# Altium schematic sheet MCU042A_HOST INTERFACE.SchDoc: Host Interface
size 558 x 431 mm; Date: Not shown in title block; ApprovedBy: Not shown in title block; CheckedBy: Not shown in title block; Author: Not shown in title block; CompanyName: Not shown in title block; DrawnBy: Vince Rodriguez; Engineer: Not shown in title block; Organization: Not shown in title block; Address1: Not shown in title block; Address2: Not shown in title block; Address3: Not shown in title block; Address4: Not shown in title block; DocumentNumber: 3; Revision: Use project parameter SCH_Rev; SheetNumber: 3; SheetTotal: 5; PageSetup: Record=PageOptions|CenterHorizontal=True|CenterVertical=True|PrintScale=1.00|XCorrection=1.00|YCorrection=1.00|PrintKind=0|BorderSize=5000000|LeftOffset=0|BottomOffset=0|Orientation=2|PaperLength=1000|PaperWidth=1000|Scale=100|PaperSource=15|PrintQuality=600|MediaType=1|DitherType=10|PaperKind=Letter|PrintScaleMode=1; CurrentTime: Not shown in title block; CurrentDate: Not shown in title block; Time: Not shown in title block; DocumentFullPathAndName: Not shown in title block; DocumentName: Not shown in title block; ModifiedDate: Not shown in title block; ImagePath: Not shown in title block
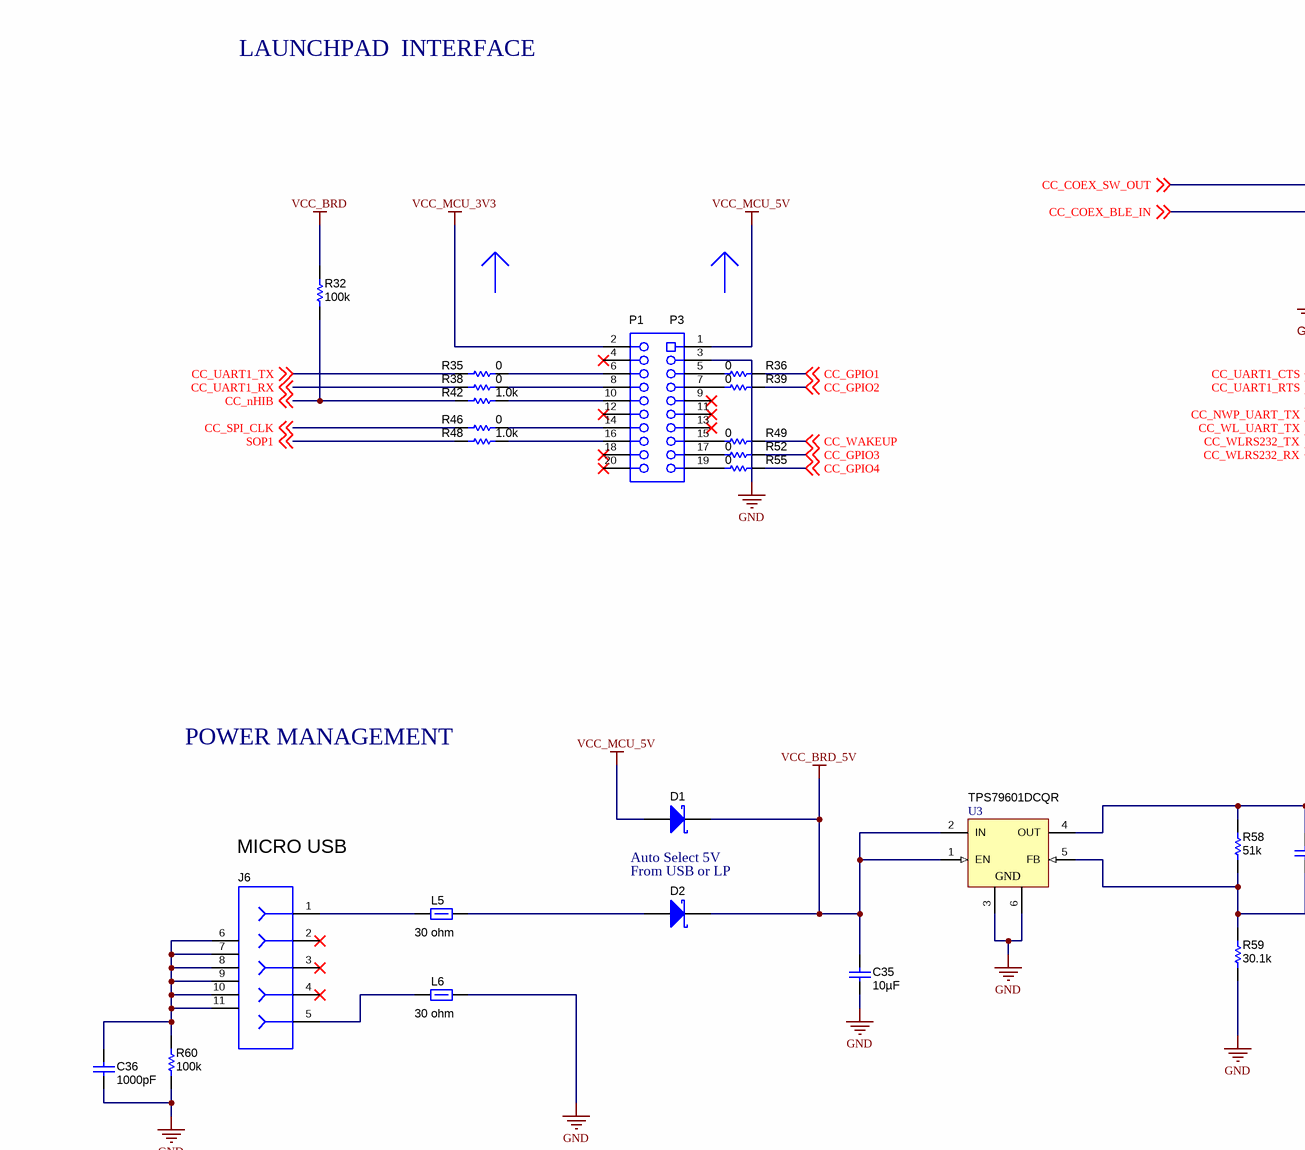
[diagram p0: MCU042A_HOST INTERFACE.SchDoc, top left]
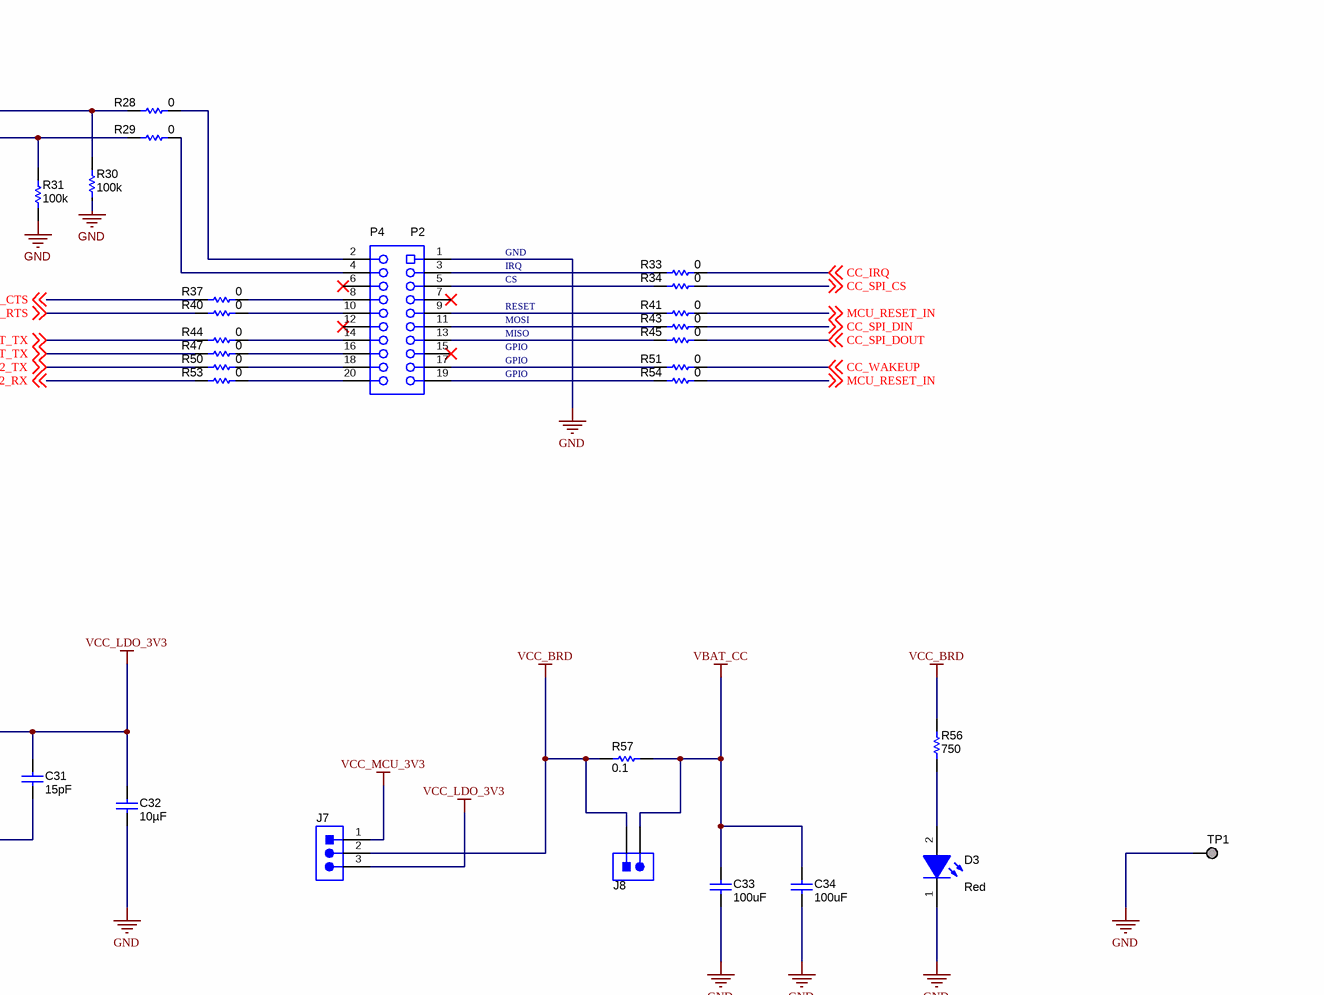
[diagram p1: MCU042A_HOST INTERFACE.SchDoc, top right]
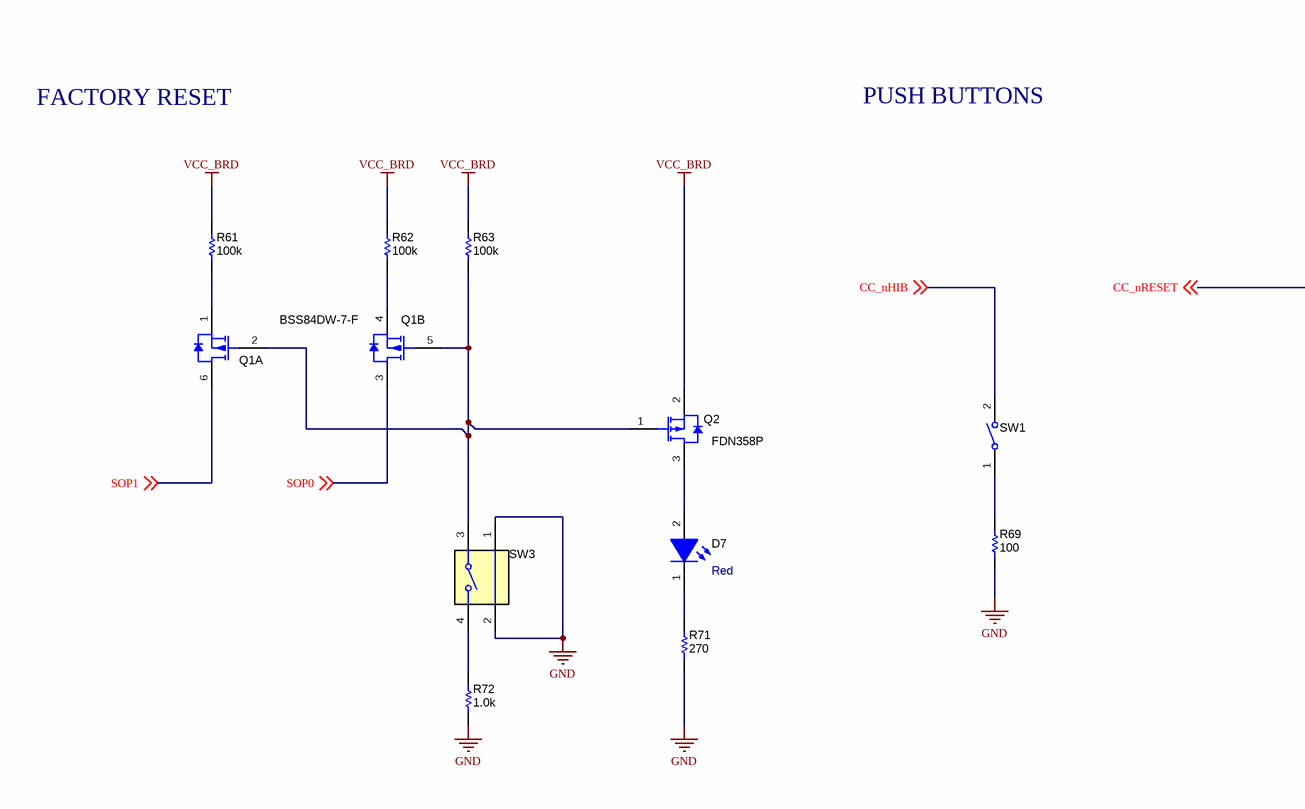
[diagram p2: MCU042A_HOST INTERFACE.SchDoc, bottom left]
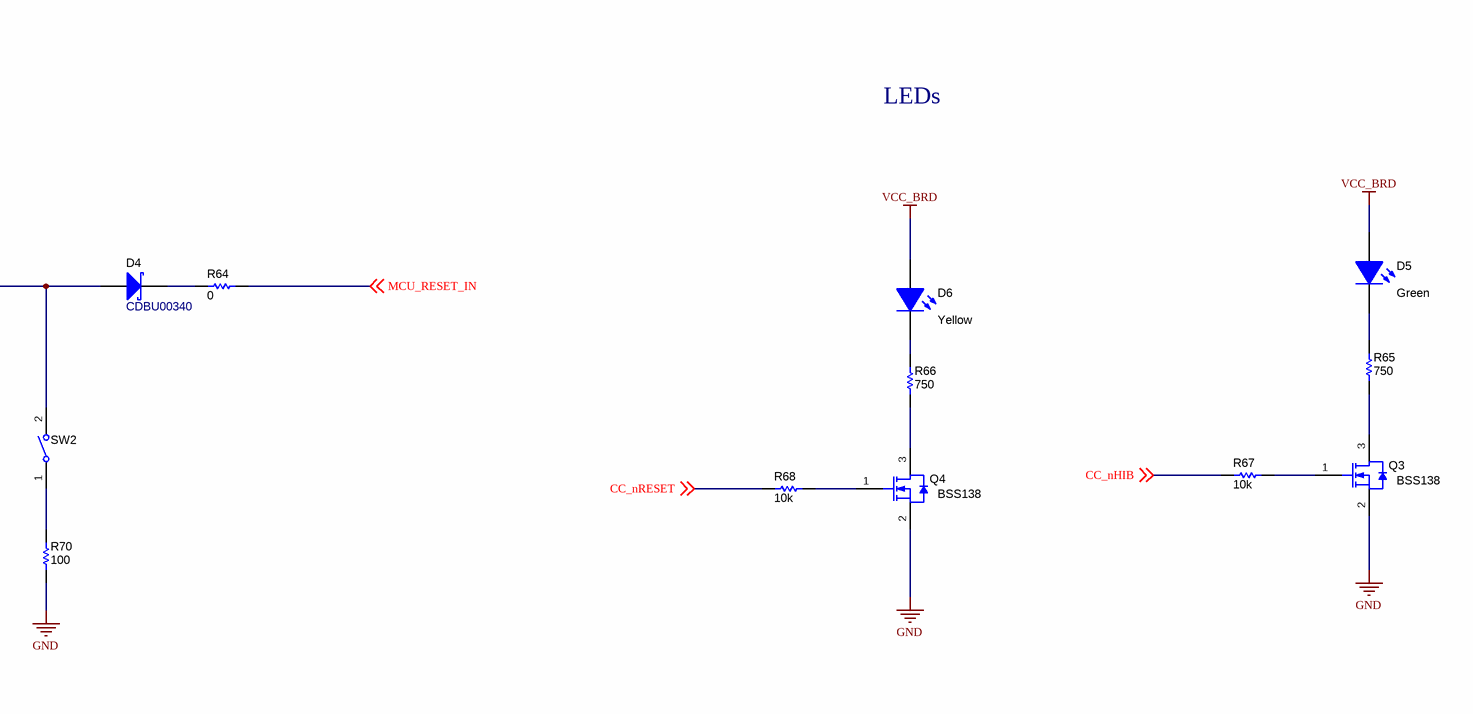
[diagram p3: MCU042A_HOST INTERFACE.SchDoc, bottom right]

## Parts
C31  ValueDisplayed: 15pF  [0402]  (hidden comment: CMP-0006420-2)
C32  ValueDisplayed: 10µF  [0805_HV]  (hidden comment: CL21A106KPFNNNE)
C33  ValueDisplayed: 100uF  [1206_180]  (hidden comment: CMP-0008934-2)
C34  ValueDisplayed: 100uF  [1206_180]  (hidden comment: CMP-0008934-2)
C35  ValueDisplayed: 10µF  [0805_HV]  (hidden comment: CL21A106KPFNNNE)
C36  ValueDisplayed: 1000pF  [0603]  (hidden comment: CL10B102KB8NNNC)
D1  CMP-0028547-1  [SOD-123]  (value not drawn)
D2  CMP-0028547-1  [SOD-123]  (value not drawn)
D3  value Red  [SML-31_Red]  (hidden comment: CMP-0002871-1)
D4  CDBU00340  [SOD-523F]
D5  value Green  [WL-SMCW_GREEN]  (hidden comment: CMP-0002905-1)
D6  value Yellow  [WL-SMCW_YELLOW]  (hidden comment: CMP-0002892-2)
D7  value Red  [SML-31_Red]  (hidden comment: CMP-0002871-2)
J6  105017-0001  [CONN_105017-0001]  (value not drawn)
J7  CMP-0075407-2  [TSW-103-07-G-S]  (value not drawn)
J8  CMP-0075500-1  [SAMTEC_HMTSW-102-07-G-S-240]  (value not drawn)
L5  value 30 ohm  [0805_HV]  (hidden comment: CMP-0003418-1)
L6  ValueDisplayed: 30 ohm  [0805_HV]  (hidden comment: CMP-0003418-1)
P1  CMP-0075442-1  [CONN_SSW-110-23-F-D]  (value not drawn)
P2  CMP-0075442-1  [CONN_SSW-110-23-F-D]  (value not drawn)
Q1  PartNumber: BSS84DW-7-F  [SOT-363]  (hidden comment: CMP-0000014-2)  (parts A,B of 2)
Q2  PartNumber: FDN358P  [SSOT-3]  (hidden comment: CMP-0000059-2)
Q3  PartNumber: BSS138  [SOT-23]  (hidden comment: CMP-0000755-1)
Q4  PartNumber: BSS138  [SOT-23]  (hidden comment: CMP-0000755-1)
R28  ValueDisplayed: 0  [0402]  (hidden comment: CMP-0026992-2)
R29  ValueDisplayed: 0  [0402]  (hidden comment: CMP-0026992-2)
R30  ValueDisplayed: 100k  [0402]  (hidden comment: CMP-0026823-3)
R31  ValueDisplayed: 100k  [0402]  (hidden comment: CMP-0026823-3)
R32  ValueDisplayed: 100k  [0603]  (hidden comment: CMP-0021990-4)
R33  ValueDisplayed: 0  [0402]  (hidden comment: CMP-0026992-2)
R34  ValueDisplayed: 0  [0402]  (hidden comment: CMP-0026992-2)
R35  ValueDisplayed: 0  [0402]  (hidden comment: CMP-0026992-2)
R36  ValueDisplayed: 0  [0402]  (hidden comment: CMP-0026992-2)
R37  ValueDisplayed: 0  [0402]  (hidden comment: CMP-0026992-2)
R38  ValueDisplayed: 0  [0402]  (hidden comment: CMP-0026992-2)
R39  ValueDisplayed: 0  [0402]  (hidden comment: CMP-0026992-2)
R40  ValueDisplayed: 0  [0402]  (hidden comment: CMP-0026992-2)
R41  ValueDisplayed: 0  [0402]  (hidden comment: CMP-0026992-2)
R42  ValueDisplayed: 1.0k  [0402]  (hidden comment: CMP-0026852-3)
R43  ValueDisplayed: 0  [0402]  (hidden comment: CMP-0026992-2)
R44  ValueDisplayed: 0  [0402]  (hidden comment: CMP-0026992-2)
R45  ValueDisplayed: 0  [0402]  (hidden comment: CMP-0026992-2)
R46  ValueDisplayed: 0  [0402]  (hidden comment: CMP-0026992-2)
R47  ValueDisplayed: 0  [0402]  (hidden comment: CMP-0026992-2)
R48  ValueDisplayed: 1.0k  [0402]  (hidden comment: CMP-0026852-3)
R49  ValueDisplayed: 0  [0402]  (hidden comment: CMP-0026992-2)
R50  ValueDisplayed: 0  [0402]  (hidden comment: CMP-0026992-2)
R51  ValueDisplayed: 0  [0402]  (hidden comment: CMP-0026992-2)
R52  ValueDisplayed: 0  [0402]  (hidden comment: CMP-0026992-2)
R53  ValueDisplayed: 0  [0402]  (hidden comment: CMP-0026992-2)
R54  ValueDisplayed: 0  [0402]  (hidden comment: CMP-0026992-2)
R55  ValueDisplayed: 0  [0402]  (hidden comment: CMP-0026992-2)
R56  ValueDisplayed: 750  [0603]  (hidden comment: CMP-0025852-4)
R57  ValueDisplayed: 0.1  [0805_HV]  (hidden comment: CMP-0021515-2)
R58  ValueDisplayed: 51k  [0402]  (hidden comment: CMP-0026945-3)
R59  ValueDisplayed: 30.1k  [0402]  (hidden comment: CMP-0026284-2)
R60  ValueDisplayed: 100k  [0402]  (hidden comment: CMP-0026823-3)
R61  ValueDisplayed: 100k  [0402]  (hidden comment: CMP-0026659-1)
R62  ValueDisplayed: 100k  [0402]  (hidden comment: CMP-0026659-1)
R63  ValueDisplayed: 100k  [0402]  (hidden comment: CMP-0026659-1)
R64  ValueDisplayed: 0  [0603]  (hidden comment: CMP-0025874-3)
R65  ValueDisplayed: 750  [0603]  (hidden comment: CMP-0025852-4)
R66  ValueDisplayed: 750  [0603]  (hidden comment: CMP-0025852-4)
R67  ValueDisplayed: 10k  [0402]  (hidden comment: CMP-0026825-5)
R68  ValueDisplayed: 10k  [0402]  (hidden comment: CMP-0026825-5)
R69  ValueDisplayed: 100  [0402]  (hidden comment: CMP-0026656-1)
R70  ValueDisplayed: 100  [0402]  (hidden comment: CMP-0026656-1)
R71  ValueDisplayed: 270  [0603]  (hidden comment: CMP-0025765-4)
R72  ValueDisplayed: 1.0k  [0402]  (hidden comment: CMP-0026852-3)
SW1  CMP-0002249-1  [SW_MJTP1117]  (value not drawn)
SW2  CMP-0002249-1  [SW_MJTP1117]  (value not drawn)
SW3  1188E-1K2-V-TR  [SW_1188E]  (value not drawn)
TP1  CMP-0003719-1  [TP_H045P075]  (value not drawn)  (no BOM)
U3  TPS79601DCQR  [DCQ0006A_N]

## Nets
GND: C32.2 C33.2 C34.2 C35.2 C36.2 D3.1(K) L6.1 P1.1 P2.3 Q3.2(S) Q4.2(S) R30.2 R31.2 R59.1 R60.2 R69.1 R70.1 R71.1 R72.1 SW3.1 SW3.2 TP1.1 U3.3(GND) U3.6(GND)
VBAT_CC: C33.1 C34.1 J8.2 R57.2
VCC_BRD: D5.2(A) D6.2(A) J7.2 J8.1 Q2.2(S) R32.2 R56.1 R57.1 R61.2 R62.2 R63.2
VCC_BRD_5V: C35.1 D1.1(K) D2.1(K) U3.1(EN) U3.2(IN)
VCC_LDO_3V3: C31.1 C32.1 J7.3 R58.2 U3.4(OUT)
VCC_MCU_3V3: J7.1 P2.2
VCC_MCU_5V: D1.2(A) P2.1
CC_COEX_BLE_IN: R29.1 R31.1 ; off-sheet CC_COEX_BLE_IN
CC_COEX_SW_OUT: R28.1 R30.1 ; off-sheet CC_COEX_SW_OUT
CC_GPIO1: R36.2 ; off-sheet CC_GPIO1
CC_GPIO2: R39.2 ; off-sheet CC_GPIO2
CC_GPIO3: R52.2 ; off-sheet CC_GPIO3
CC_GPIO4: R55.2 ; off-sheet CC_GPIO4
CC_IRQ: R33.2 ; off-sheet CC_IRQ
CC_nHIB: R32.1 R42.1 R67.1 SW1.2 ; off-sheet CC_nHIB
CC_nRESET: D4.2(A) R68.1 SW2.2 ; off-sheet CC_nRESET
CC_NWP_UART_TX: R44.1 ; off-sheet CC_NWP_UART_TX
CC_SPI_CLK: R46.1 ; off-sheet CC_SPI_CLK
CC_SPI_CS: R34.2 ; off-sheet CC_SPI_CS
CC_SPI_DIN: R43.2 ; off-sheet CC_SPI_DIN
CC_SPI_DOUT: R45.2 ; off-sheet CC_SPI_DOUT
CC_UART1_CTS: R37.1 ; off-sheet CC_UART1_CTS
CC_UART1_RTS: R40.1 ; off-sheet CC_UART1_RTS
CC_UART1_RX: R38.1 ; off-sheet CC_UART1_RX
CC_UART1_TX: R35.1 ; off-sheet CC_UART1_TX
CC_WAKEUP: R49.2 R51.2 ; off-sheet CC_WAKEUP
CC_WL_UART_TX: R47.1 ; off-sheet CC_WL_UART_TX
CC_WLRS232_RX: R53.1 ; off-sheet CC_WLRS232_RX
CC_WLRS232_TX: R50.1 ; off-sheet CC_WLRS232_TX
MCU_RESET_IN: R41.2 R54.2 R64.2 ; off-sheet MCU_RESET_IN
SOP0: Q1.3(D) ; off-sheet SOP0
SOP1: Q1.6(D) R48.1 ; off-sheet SOP1
NetC31_2: C31.2 R58.1 R59.2 U3.5(FB)
NetC36_1: C36.1 J6.6 J6.7 J6.8 J6.9 J6.10 J6.11 R60.1
NetD2_2: D2.2(A) L5.2
NetD3_2: D3.2(A) R56.2
NetD4_1: D4.1(K) R64.1
NetD5_1: D5.1(K) R65.1
NetD6_1: D6.1(K) R66.1
NetD7_1: D7.1(K) R71.2
NetD7_2: D7.2(A) Q2.3(D)
NetJ6_1: J6.1 L5.1
NetJ6_5: J6.5 L6.2
NetP1_2: P1.2 R28.2
NetP1_3: P1.3 R33.1
NetP1_4: P1.4 R29.2
NetP1_5: P1.5 R34.1
NetP1_8: P1.8 R37.2
NetP1_9: P1.9 R41.1
NetP1_10: P1.10 R40.2
NetP1_11: P1.11 R43.1
NetP1_13: P1.13 R45.1
NetP1_14: P1.14 R44.2
NetP1_16: P1.16 R47.2
NetP1_17: P1.17 R51.1
NetP1_18: P1.18 R50.2
NetP1_19: P1.19 R54.1
NetP1_20: P1.20 R53.2
NetP2_5: P2.5 R36.1
NetP2_6: P2.6 R35.2
NetP2_7: P2.7 R39.1
NetP2_8: P2.8 R38.2
NetP2_10: P2.10 R42.2
NetP2_14: P2.14 R46.2
NetP2_15: P2.15 R49.1
NetP2_16: P2.16 R48.2
NetP2_17: P2.17 R52.1
NetP2_19: P2.19 R55.1
NetQ1_1: Q1.1(S) R61.1
NetQ1_2: Q1.2(G) Q1.5(G) Q2.1(G) R63.1 SW3.3
NetQ1_4: Q1.4(S) R62.1
NetQ3_1: Q3.1(G) R67.2
NetQ3_3: Q3.3(D) R65.2
NetQ4_1: Q4.1(G) R68.2
NetQ4_3: Q4.3(D) R66.2
NetR69_2: R69.2 SW1.1
NetR70_2: R70.2 SW2.1
NetR72_2: R72.2 SW3.4

Not connected (* = marked no-connect by the designer): J6 2* 3* 4*; P1 6* 7* 12* 15*; P2 4* 9* 11* 12* 13* 18* 20*

## Notes on the sheet
- LAUNCHPAD  INTERFACE
- (near P2) P1
- (near P2) P3
- (near P1) P4
- (near P1) P2
- GND
- IRQ
- CS
- RESET
- MOSI
- MISO
- GPIO
- POWER MANAGEMENT
- MICRO USB
- Auto Select 5V
- From USB or LP
- FACTORY RESET
- PUSH BUTTONS
- LEDs
- Drawn By:
- SVN Rev:
- Number:
- TID #:
- Orderable:
- Rev:
- Sheet Title:
- File:
- Project Title:
- Designed for:
- Assembly Variant:
- Mod. Date:
- Sheet:
- Size:
- of
- C
- http://www.ti.com
- Texas Instruments and/or its licensors do not warrant the accuracy or completeness of this specification or any information contained therein. Texas Instruments and/or its licensors do not warrant that this design will meet the specifications, will be suitable for your application or fit for any particular purpose, or will operate in an implementation. Texas Instruments and/or its licensors do not warrant that the design is production worthy. You should completely validate and test your design implementation to confirm the system functionality for your application.
- Engineer:
- Contact:
- © Texas Instruments

## Library data of the parts
C31 = CMP-0006420-2: CAP, CERM, 15 pF, 50 V, +/- 5%, C0G/NP0, 0402; PartNumber: CL05C150JB5NNNC; Manufacturer: SAMSUNG; Alternate PartNumber: GRM1555C1H150JA01D; Alternate Manufacturer: MuRata; Polarized: N; CompType: Capacitor; Value: 15pF; U/M: EA; Value1: Unknown; VDC_V: 50V; TaMin_C: -55°C; TaMax_C: 125°C; SizeAreaWB_mm2: 3; SizeZ_mm: 0.6; SizeX_mm: 1; SizeY_mm: 0.5; AEC Category: Q200; PackageReference: 0402; RoHS: Y; Cap_F: 15pF; Tolerance_%: 5%; Value2: 50V; MountType: SMT; Technology: Ceramic; TempCo: C0G/NP0; Cap_Case: 0402; Published: 2008-06-19; Publisher: Texas Instruments; LatestRevisionDate: 2017-03-09; ComponentLink1Description: Datasheet link; ComponentLink1URL: http://search.murata.co.jp/Ceramy/PnsearchViewAction.do?HnOFG=ON&HnNFG=ON&SEL_CNT=50&sLang=en&sKey=GRM1555C1H150JA01D&x=9&y=9&search=startwith; Supplier 1: Mouser; Supplier Part Number 1: CL05C150JB5NNNC; SizeArea_mm2: 0.5; AEC Qualified: ?
C32 C35 = CMP-0084772-1: CAP, CERM, 10 µF, 10 V,+/- 10%, X5R, 0805; Manufacturer: Samsung Electro-Mechanics; Alternate PartNumber: GRM21BR61A106KE19L; Polarized: N; Value: 10uF; U/M: EA; VDC_V: 10V; TaMin_C: -55°C; TaMax_C: 85°C; Cap_Case: 0805; SizeAreaWB_mm2: 6.75; SizeZ_mm: 1.45; SizeX_mm: 2; SizeY_mm: 1.25; SizeArea_mm2: 2.5; AEC Category: Q200; CompType: Capacitor; PartNumber: CL21A106KPFNNNE; PackageReference: 0805; RoHS: Y; Cap_F: 10µF; Tolerance_%: 10%; Value2: 10V; MountType: SMT; Technology: Ceramic; TempCo: X5R; ComponentLink1Description: Datasheet link; ComponentLink1URL: http://www.samsungsem.com/kr/support/product-search/mlcc/__icsFiles/afieldfile/2018/06/20/CL21A106KPFNNNE.pdf; AEC Qualified: N; AEC Grade: N/A
C33 C34 = CMP-0008934-2: CAP, CERM, 100 uF, 6.3 V, +/- 20%, X5R, 1206; PartNumber: GRM31CR60J107ME39L; Manufacturer: MuRata; Alternate PartNumber: CL31A107MQHNNNE; Alternate Manufacturer: SAMSUNG; Polarized: N; CompType: Capacitor; Value: 100uF; U/M: EA; Cap_F: 100µF; ESR_ohm: 3m; Value1: 0.003 ohm; VDC_V: 6.3V; TaMin_C: -55°C; TaMax_C: 85°C; Cap_Case: 1206; SizeAreaWB_mm2: 10.92; SizeZ_mm: 1.8; SizeX_mm: 3.2; SizeY_mm: 1.6; SizeArea_mm2: 5.12; AEC Category: Q200; PackageReference: 1206; RoHS: Y; Tolerance_%: 20%; Value2: 6.3V; MountType: SMT; Technology: Ceramic; TempCo: X5R; Published: 2008-06-19; Publisher: Texas Instruments; LatestRevisionDate: 2017-03-09; ComponentLink1Description: Datasheet link; ComponentLink1URL: http://search.murata.co.jp/Ceramy/PnsearchViewAction.do?HnOFG=ON&HnNFG=ON&SEL_CNT=50&sLang=en&sKey=GRM31CR60J107ME39L&x=9&y=9&search=startwith; Supplier 1: Digi-Key; Supplier Part Number 1: 490-4539-1-ND; Supplier 2: Mouser; Supplier Part Number 2: 81-GRM31CR60J107ME9L; Supplier 3: Farnell; Supplier Part Number 3: 1735535; AEC Qualified: ?
C36 = CMP-0084856-1: CAP, CERM, 1000 pF, 50 V,+/- 10%, X7R, 0603; Manufacturer: Samsung Electro-Mechanics; Alternate PartNumber: GRM188R61H102KA01D; Polarized: N; Value: 1000pF; U/M: EA; Cap_F: 1nF; VDC_V: 50V; TaMin_C: -55°C; TaMax_C: 125°C; SizeAreaWB_mm2: 4.68; SizeZ_mm: 1; SizeX_mm: 1.6; SizeY_mm: 0.8; SizeArea_mm2: 1.28; AEC Category: Q200; CompType: Capacitor; PartNumber: CL10B102KB8NNNC; PackageReference: 0603; RoHS: Y; Tolerance_%: 10%; Value2: 50V; MountType: SMT; Technology: Ceramic; TempCo: X7R; Cap_Case: 0603; ComponentLink1Description: Datasheet link; ComponentLink1URL: http://www.samsungsem.com/kr/support/product-search/mlcc/__icsFiles/afieldfile/2018/07/24/CL10B102KB8NNNC.pdf; AEC Qualified: N; AEC Grade: N/A
D1 D2 = CMP-0028547-1: Diode, Schottky, 30 V, 1 A, SOD-123; PartNumber: MBR130T1G; Manufacturer: ON Semiconductor; Alternate Manufacturer: ----; U/M: EA; Vf_V: 4.7dV; Value: 30V; Value1: 1A; Value2: 0.47V; TJmax_C: 125°C; RJC_CperW: 108; Green_Lifecycle: Active; SizeAreaWB_mm2: 13.095; Green_REACh: Passed; SizeZ_mm: 1.35; SizeX_mm: 3.85; SizeY_mm: 1.7; SizeArea_mm2: 6.545; AEC Category: Q101; CompType: Diode; PackageReference: SOD-123; Io_A: 1A; Vr_V: 30V; MountType: SMT; Type: Schottky; RoHS: Y; Published: 2008-06-26; Publisher: Texas Instruments; LatestRevisionDate: 2017-05-08; ComponentLink1Description: Datasheet link; ComponentLink1URL: http://www.onsemi.com/pub_link/Collateral/MBR130T1-D.PDF; Alternate PartNumber: ----; Supplier 1: Digi-Key; Supplier Part Number 1: MBR130T1GOSCT-ND; Supplier 2: Newark; Supplier Part Number 2: 84K8740; Supplier 3: Mouser; Supplier Part Number 3: 863-MBR130T1G; Green_EU RoHS-2: Passed; Green_EU RoHS: Passed; AEC Qualified: ?
D3 = CMP-0002871-1: LED, Red, SMD; Manufacturer: Everlight; PartNumber: 19-217/R6C-AL1M2VY/3T; Alternate Manufacturer: Rohm; Alternate PartNumber: SML-311UTT86; Type: AlInGaP; Vf_V: 1.8V; Io_A: 2mA; Value1: W; U/M: EA; CompType: LED; MountType: SMT; RoHS: Y; PackageReference: LED, 1.6x.8x.8mm; Value2: 1.8V; Color: red; Published: 2008-07-11; Publisher: Texas Instruments; ComponentLink1URL: http://rohmfs.rohm.com/en/products/databook/datasheet/opto/led/chip_mono/sml-31.pdf; ComponentLink1Description: Datasheet link; LatestRevisionDate: 2017-03-09; Supplier 1: Digi-Key; Supplier 2: Newark; Supplier 3: Mouser
D4 = CMP-0081923-2: Diode, Schottky, 45 V, 0.03 A, SOD-523F; Manufacturer: Comchip Technology; Alternate PartNumber: CD0603-B00340; Vf_V: 370mV; Value: 45V; Value1: 0.03A; Value2: 0.37V; Io_A: 30mA; TJmax_C: 125°C; SizeAreaWB_mm2: 5.13; SizeZ_mm: 0.85; SizeX_mm: 1.7; SizeY_mm: 0.9; SizeArea_mm2: 1.53; AEC Qualified: N; AEC Category: Q101; CompType: Diode; PartNumber: CDBU00340; PackageReference: SOD-523F; Vr_V: 45V; MountType: SMT; Type: Schottky; RoHS: Y; ComponentLink1Description: Datasheet link; ComponentLink1URL: http://www.comchiptech.com/cms/UserFiles/CDBU00340-RevA718649.pdf
D5 = CMP-0002905-1: LED, Green, SMD; Manufacturer: Wurth Elektronik; PartNumber: 150060GS75000; Alternate Manufacturer: Everlight; Alternate PartNumber: 19-217/GHC-YR1S2/3T; Type: InGaN; Vf_V: 3.2V; Io_A: 20mA; Tjmax_C: 85°C; Value1: W; Angle: 140; U/M: EA; CompType: LED; MountType: SMT; RoHS: Y; PackageReference: LED_0603; Value2: 3.2V; Color: Green; Published: 2008-07-11; Publisher: Texas Instruments; ComponentLink1URL: http://katalog.we-online.de/led/datasheet/150060GS75000.pdf; ComponentLink1Description: Datasheet link; LatestRevisionDate: 2017-03-09; Supplier 1: Digi-Key; Supplier Part Number 1: 732-4971-1-ND; Supplier 2: Newark; Supplier Part Number 2: 95W3794; Supplier 3: Mouser; Supplier Part Number 3: 710-150060GS75000
D6 = CMP-0002892-2: LED, Yellow, SMD; Manufacturer: Wurth Elektronik; PartNumber: 150060YS75000; Alternate Manufacturer: Everlight; Alternate PartNumber: 19-217/Y5C-AM1N1VY/3T; Type: AlInGaP; Vf_V: 2V; Io_A: 20mA; Value1: W; U/M: EA; CompType: LED; MountType: SMT; RoHS: Y; PackageReference: LED_0603; Value2: 2V; Color: yellow; Published: 2008-07-11; Publisher: Texas Instruments; ComponentLink1URL: http://katalog.we-online.de/led/datasheet/150060YS75000.pdf; ComponentLink1Description: Datasheet link; LatestRevisionDate: 2017-03-09; Supplier 1: Digi-Key; Supplier Part Number 1: 732-4981-1-ND; Supplier 2: Newark; Supplier Part Number 2: 95W3798; Supplier 3: Farnell; Supplier Part Number 3: 2322074
D7 = CMP-0002871-2: LED, Red, SMD; Manufacturer: everlight; PartNumber: 19-217/R6C-AL1M2VY/3T; Alternate Manufacturer: Rohm; Alternate PartNumber: SML-311UTT86; Type: AlInGaP; Vf_V: 1.8V; Io_A: 2mA; Value1: W; CompType: LED; MountType: SMT; RoHS: Y; PackageReference: LED, 1.6x.8x.8mm; Value2: 1.8V; Color: red; ComponentLink1URL: http://rohmfs.rohm.com/en/products/databook/datasheet/opto/led/chip_mono/sml-31.pdf; ComponentLink1Description: Datasheet link
J6 = CMP-0055293-1: Connector, Receptacle, Micro-USB Type B, R/A, Bottom Mount SMT; Manufacturer: Molex; Alternate Manufacturer: ----; SymbolCreator: a0412235; U/M: EA; SymbolVersion: 2012-12-19; PartNumber: 105017-0001; PackageReference: Micro USB receptacle; CompType: Receptacle; RoHS: Y; MountType: SMT; ComponentLink1Description: Datasheet Link; ComponentLink1URL: http://www.molex.com/pdm_docs/sd/1050170001_sd.pdf; Publisher: Texas Instruments; LatestRevisionDate: 2015-06-05; Alternate PartNumber: ----; Supplier 1: Digi-Key; Supplier Part Number 1: WM1399CT-ND; Supplier 2: Mouser; Supplier Part Number 2: 538-105017-0001; Supplier 3: Farnell; Supplier Part Number 3: 1847433
J7 = CMP-0075407-2: Header, 100mil, 3x1, Gold, TH; Manufacturer: Samtec; Alternate Manufacturer: ----; Pitch_mm: 2.54; Cert_VDE: N; Gender: Male; Cert_CSA: Y; Voltage_V: 550V; Green_REACh: Passed; Current_A: 6.3A; Green_Lifecycle: Active; Row_Count: 1; PartNumber: TSW-103-07-G-S; PackageReference: 3x1 Header; ClassName: Header; CompType: Header; RoHS: Y; MountType: TH; ComponentLink1Description: Datasheet URL; ComponentLink1URL: http://samtec.com/ftppub/pdf/TSW_TH.PDF; Alternate PartNumber: ----; Supplier 1: Digi-Key; Supplier Part Number 1: SAM1029-03-ND; Cert_UL: Y; Orientation: Vertical; Green_EU RoHS: Passed; Color: Black; PinCount: 3; ContactFinish: Gold; Cert_CULUS: N; Shrouded: N; Green_EU RoHS-2: Passed
J8 = CMP-0075500-1: Header, 100mil, 2x1, Gold, TH; PartNumber: HMTSW-102-07-G-S-240; Manufacturer: Samtec; Alternate Manufacturer: ----; Green_REACh: Passed; CT: False; Green_Lifecycle: Active; CNHeader: True; PackageReference: Header, 2.54mm, 2x1, TH; ClassName: Header; CompType: Header; RoHS: Y; MountType: TH; ComponentLink1Description: Datasheet URL; ComponentLink1URL: http://www.samtec.com/documents/webfiles/cpdf/HMTSW-XXX-XX-X-X-XXXX-XX-XX-MKT1.pdf; Publisher: Texas Instruments; LatestRevisionDate: 2017-07-12; Alternate PartNumber: ----; Supplier 1: Digi-Key; Supplier Part Number 1: HMTSW-102-07-G-S-240-ND; Supplier 2: Newark; Supplier Part Number 2: 50P9702; Green_EU RoHS: Passed; Green_EU RoHS-2: Passed
L5 = CMP-0003418-1: Ferrite Bead, 30 ohm @ 100 MHz, 1.5 A, 0805; PartNumber: MMZ2012R300AT000; Manufacturer: TDK; Alternate PartNumber: ----; Imax_A: 1.5A; DCR_ohm: 0.05; Value1: 0.05 ohm; ZTyp@100MHz_Ohm: 30; SizeAreaWB_mm2: 6.75; SizeZ_mm: 1.45; SizeX_mm: 2; SizeY_mm: 1.25; SizeArea_mm2: 2.5; CompType: Ferrite Bead; Value2: 1.5A; MountType: SMT; PackageReference: 0805; Published: 2014-04-30; Publisher: Texas Instruments; LatestRevisionDate: 2017-03-09; ComponentLink1Description: Datasheet link; ComponentLink1URL: http://www.tdk.co.jp/tefe02/e9412_mmz.pdf; RoHS: Y; Alternate Manufacturer: ----; Supplier 1: Digi-Key; Supplier Part Number 1: 445-2199-1-ND; Supplier 2: Newark; Supplier Part Number 2: 89R3113; Supplier 3: Mouser; Supplier Part Number 3: 810-MMZ2012R300AT000; ValueDisplayed: 30 ohm
L6 = CMP-0003418-1: Ferrite Bead, 30 ohm @ 100 MHz, 1.5 A, 0805; PartNumber: MMZ2012R300AT000; Manufacturer: TDK; Alternate PartNumber: ----; Value: 30 ohm; Imax_A: 1.5A; DCR_ohm: 0.05; Value1: 0.05 ohm; ZTyp@100MHz_Ohm: 30; SizeAreaWB_mm2: 6.75; SizeZ_mm: 1.45; SizeX_mm: 2; SizeY_mm: 1.25; SizeArea_mm2: 2.5; CompType: Ferrite Bead; Value2: 1.5A; MountType: SMT; PackageReference: 0805; Published: 2014-04-30; Publisher: Texas Instruments; LatestRevisionDate: 2017-03-09; ComponentLink1Description: Datasheet link; ComponentLink1URL: http://www.tdk.co.jp/tefe02/e9412_mmz.pdf; RoHS: Y; Alternate Manufacturer: ----; Supplier 1: Digi-Key; Supplier Part Number 1: 445-2199-1-ND; Supplier 2: Newark; Supplier Part Number 2: 89R3113; Supplier 3: Mouser; Supplier Part Number 3: 810-MMZ2012R300AT000
P1 P2 = CMP-0075442-1: Connector, Receptacle, 100mil, 10x2, Gold plated, TH; PartNumber: SSW-110-23-F-D; Manufacturer: Samtec; Alternate Manufacturer: Major League; Alternate PartNumber: CRD-081413-A-G; CompType: Socket Strip; Green_Lifecycle: Active; Green_REACh: Passed; CT: True; CNHeader: False; PackageReference: 10x2 Receptacle; RoHS: Y; MountType: TH; ComponentLink1Description: Datasheet URL; ComponentLink1URL: http://www.samtec.com/technical-specifications/default.aspx?SeriesMaster=SSW; Publisher: Texas Instruments; LatestRevisionDate: 2017-07-12; Green_EU RoHS-2: Passed; Green_EU RoHS: Passed
Q1 = CMP-0000014-2: MOSFET, 2-CH, P-CH, -50 V, -0.13 A, AEC-Q101, SOT-363; Manufacturer: Diodes Inc.; Alternate Manufacturer: ----; U/M: EA; ChType: P; Value: -50V; Vgs_V: -20V; IdsMax_A: -1.3dA; AEC Category: Q101; AEC Qualified: Y; SizeZ_mm: 1.1; SizeX_mm: 2.2; SizeArea_mm2: 4.84; SizeAreaWB_mm2: 10.24; PackageReference: SOT-363; CompType: MOSFET; VdsMax_V: -50V; RoHS: Y; MountType: SMT; Published: 2008-06-19; Publisher: Texas Instruments; LatestRevisionDate: 2017-03-09; LatestRevisionNote: Added parts.; ComponentLink1Description: Datasheet link; ComponentLink1URL: http://www.diodes.com/_files/datasheets/ds30204.pdf; Alternate PartNumber: ----; Supplier 1: Digi-Key; Supplier Part Number 1: BSS84DW-FDICT-ND; Supplier 2: Newark; Supplier Part Number 2: 25R4431; Supplier 3: Mouser; Supplier Part Number 3: 621-BSS84DW-F; SizeY_mm: 2.2
Q2 = CMP-0000059-2: MOSFET, P-CH, -30 V, -1.5 A, SSOT-3; Manufacturer: Fairchild Semiconductor; Alternate Manufacturer: ----; U/M: EA; ChType: P; Value: -30V; Value1: 0; Rdson45_ohm: 2d; Value2: 4 nC; QgTyp_nC: 4; Vgs_V: -20V; IdsMax_A: -1.5A; SizeZ_mm: 1.12; SizeX_mm: 2.92; SizeY_mm: 2.52; SizeArea_mm2: 7.3584; AEC Category: Q101; SizeAreaWB_mm2: 13.7984; PackageReference: SSOT-3; CompType: MOSFET; VdsMax_V: -30V; RoHS: Y; MountType: SMT; Published: 2008-06-19; Publisher: Texas Instruments; LatestRevisionDate: 2017-03-09; LatestRevisionNote: Added parts.; ComponentLink1Description: Datasheet link; ComponentLink1URL: http://www.fairchildsemi.com/ds/FD/FDN358P.pdf; Alternate PartNumber: ----; Supplier 1: Digi-Key; Supplier Part Number 1: FDN358PCT-ND; Supplier 2: Newark; Supplier Part Number 2: 32C6163; Supplier 3: Mouser; Supplier Part Number 3: 512-FDN358P; AEC Qualified: ?
Q3 Q4 = CMP-0000755-1: MOSFET, N-CH, 50 V, 0.22 A, SOT-23; Manufacturer: Fairchild Semiconductor; Alternate Manufacturer: ON; Alternate PartNumber: BSS138LT1G; U/M: EA; ChType: N; Value: 50V; Rdson45_ohm: 6; Value2: 1.7 nC; QgTyp_nC: 1.7; Vgs_V: 20V; IdsMax_A: 2.2dA; SizeZ_mm: 1.1; SizeX_mm: 2.5; SizeY_mm: 3; SizeArea_mm2: 7.5; AEC Category: Q101; SizeAreaWB_mm2: 14; CompType: MOSFET; PackageReference: SOT-23; VdsMax_V: 50V; RoHS: Y; MountType: SMT; Published: 2008-06-19; Publisher: Texas Instruments; LatestRevisionDate: 2017-03-09; LatestRevisionNote: Added parts.; ComponentLink1Description: Datasheet link; ComponentLink1URL: http://www.fairchildsemi.com/ds/BS/BSS138.pdf; Supplier 1: Digi-Key; Supplier Part Number 1: BSS138CT-ND; Supplier 2: Newark; Supplier Part Number 2: 58K8769; Supplier 3: Mouser; Supplier Part Number 3: 512-BSS138; AEC Qualified: ?
R28 R29 R33-R41 R43-R47 R49-R55 = CMP-0026992-2: RES, 0, 5%, 0.063 W, 0402; PartNumber: ERJ-2GE0R00X; Manufacturer: Panasonic; Alternate Manufacturer: YAGEO; Alternate PartNumber: RC0402JR-070RL; Value: 0; Value_Code: 0000; Power_W: 63mW; Value2: 0.063W; VDC_V: 50V; TempCo: 600 ppm/C; EIA_Code: E24; U/M: EA; SizeX_mm: 1; SizeY_mm: 0.5; SizeZ_mm: 0.6; AEC Category: Q200; CompType: Resistor; PackageReference: 0402; RoHS: Y; Res_ohm: 0; Tolerance_%: 5%; Value1: 5%; MountType: SMT; Technology: Thick Film; Published: 2008-06-26; Publisher: Texas Instruments; LatestRevisionDate: 2017-03-09; ComponentLink1Description: Datasheet link; ComponentLink1URL: http://www.panasonic.com/industrial/components/pdf/AOA0000CE1.pdf; Supplier 1: Digi-Key; Supplier Part Number 1: P0.0JCT-ND; Supplier 2: Newark; Supplier Part Number 2: 65T8307; Supplier 3: Mouser; Supplier Part Number 3: 667-ERJ-2GE0R00X; SizeArea_mm2: 0.5; AEC Qualified: ?
R30 R31 R60 = CMP-0026823-3: RES, 100 k, 5%, 0.063 W, AEC-Q200 Grade 0, 0402; PartNumber: CRCW0402100KJNED; Manufacturer: Vishay-Dale; Alternate Manufacturer: YAGEO; Alternate PartNumber: RC0402JR-07100KL; Value: 100k; Power_W: 63mW; Value2: 0.063W; VDC_V: 50V; TempCo: 200 ppm/C; EIA_Code: E24; SizeX_mm: 1; SizeY_mm: 0.5; SizeZ_mm: 0.6; AEC Qualified: Y; AEC Category: Q200; AEC Grade: 0; CompType: Resistor; PackageReference: 0402; RoHS: E; Res_ohm: 100k; Value_Code: 100k; Tolerance_%: 5%; Value1: 5%; MountType: SMT; Technology: Thick Film; ComponentLink1Description: Datasheet link; ComponentLink1URL: http://www.vishay.com/docs/20035/dcrcwe3.pdf; Supplier 1: Digi-Key; Supplier Part Number 1: 541-100KJCT-ND; Supplier 2: Newark; Supplier Part Number 2: 59M6699; Supplier 3: Mouser; Supplier Part Number 3: 71-CRCW0402J-100K-E3; SizeArea_mm2: 0.5
R32 = CMP-0021990-4: RES, 100 k, 1%, 0.1 W, AEC-Q200 Grade 0, 0603; PartNumber: CRCW0603100KFKEA; Manufacturer: Vishay-Dale; Alternate Manufacturer: YAGEO; Alternate PartNumber: RC0603FR-07100KL; CompType: Resistor; Value: 100k; Power_W: 100mW; Value2: 0.1W; VDC_V: 75V; TempCo: 100 ppm/C; EIA_Code: E96; SizeX_mm: 1.6; SizeY_mm: 0.8; SizeZ_mm: 1; SizeArea_mm2: 1.28; AEC Qualified: Y; AEC Category: Q200; AEC Grade: 0; PackageReference: 0603; RoHS: E; Res_ohm: 100k; Value_Code: 100k; Tolerance_%: 1%; Value1: 1%; MountType: SMT; Technology: Thick Film; ComponentLink1Description: Datasheet link; ComponentLink1URL: http://www.vishay.com/docs/20035/dcrcwe3.pdf; Supplier 1: Digi-Key; Supplier Part Number 1: 541-100KHCT-ND; Supplier 2: Newark; Supplier Part Number 2: 42K3668; Supplier 3: Mouser; Supplier Part Number 3: 71-CRCW0603-100K-E3
R42 R48 = CMP-0026852-3: RES, 1.0 k, 5%, 0.063 W, AEC-Q200 Grade 0, 0402; PartNumber: CRCW04021K00JNED; Manufacturer: Vishay-Dale; Alternate Manufacturer: YAGEO; Alternate PartNumber: RC0402JR-071KL; Value: 1.0k; Res_ohm: 1k; Value_Code: 1k00; Power_W: 63mW; Value2: 0.063W; VDC_V: 50V; TempCo: 200 ppm/C; EIA_Code: E24; SizeX_mm: 1; SizeY_mm: 0.5; SizeZ_mm: 0.6; AEC Qualified: Y; AEC Category: Q200; AEC Grade: 0; CompType: Resistor; PackageReference: 0402; RoHS: E; Tolerance_%: 5%; Value1: 5%; MountType: SMT; Technology: Thick Film; ComponentLink1Description: Datasheet link; ComponentLink1URL: http://www.vishay.com/docs/20035/dcrcwe3.pdf; Supplier 1: Digi-Key; Supplier Part Number 1: 541-1.0KJCT-ND; Supplier 2: Newark; Supplier Part Number 2: 59M6691; Supplier 3: Mouser; Supplier Part Number 3: 71-CRCW0402J-1.0K-E3; SizeArea_mm2: 0.5
R56 R66 = CMP-0025852-4: RES, 750, 5%, 0.1 W, AEC-Q200 Grade 0, 0603; PartNumber: CRCW0603750RJNEA; Manufacturer: Vishay-Dale; Alternate Manufacturer: YAGEO; Alternate PartNumber: RC0603JR-07750RL; Value: 750; Value_Code: 750R; Power_W: 100mW; Value2: 0.1W; VDC_V: 75V; TempCo: 200 ppm/C; EIA_Code: E24; SizeArea_mm2: 1.28; SizeX_mm: 1.6; SizeY_mm: 0.8; SizeZ_mm: 1; AEC Category: Q200; AEC Qualified: Y; AEC Grade: 0; CompType: Resistor; PackageReference: 0603; RoHS: E; Res_ohm: 750; Tolerance_%: 5%; Value1: 5%; MountType: SMT; Technology: Thick Film; ComponentLink1Description: Datasheet link; ComponentLink1URL: http://www.vishay.com/docs/20035/dcrcwe3.pdf; Supplier 1: Digi-Key; Supplier Part Number 1: 541-750GCT-ND; Supplier 2: Mouser; Supplier Part Number 2: 71-CRCW0603J-750-E3
R57 = CMP-0021515-2: RES, 0.1, 1%, 0.25 W, 0805; PartNumber: CRM0805-FX-R100ELF; Manufacturer: Bourns; Alternate Manufacturer: ----; CompType: Resistor; Value: 0.1; Res_ohm: 1d; Value_Code: R100; Power_W: 250mW; Value2: 0.25W; VDC_V: 0V; TempCo: 150 ppm/C; EIA_Code: E96; U/M: EA; SizeX_mm: 2; SizeY_mm: 1.25; SizeZ_mm: 1.45; SizeArea_mm2: 2.5; AEC Category: Q200; PackageReference: 0805; RoHS: Y; Tolerance_%: 1%; Value1: 1%; MountType: SMT; Technology: Film; Published: 2008-06-26; Publisher: Texas Instruments; LatestRevisionDate: 2017-03-09; ComponentLink1Description: Datasheet link; ComponentLink1URL: http://www.bourns.com/data/global/pdfs/CRM0805_1206_2010.pdf; Alternate PartNumber: ----; Supplier 1: Mouser; Supplier Part Number 1: 652-CRM0805FXR100ELF; Supplier 2: Farnell; Supplier Part Number 2: 1865233; AEC Qualified: ?
R58 = CMP-0026945-3: RES, 51 k, 5%, 0.063 W, AEC-Q200 Grade 0, 0402; PartNumber: CRCW040251K0JNED; Manufacturer: Vishay-Dale; Alternate Manufacturer: YAGEO; Alternate PartNumber: RC0402JR-0751KL; CompType: Resistor; Value: 51k; Value_Code: 51k0; Power_W: 63mW; Value2: 0.063W; VDC_V: 50V; TempCo: 200 ppm/C; EIA_Code: E24; SizeX_mm: 1; SizeY_mm: 0.5; SizeZ_mm: 0.6; AEC Qualified: Y; AEC Category: Q200; AEC Grade: 0; PackageReference: 0402; RoHS: E; Res_ohm: 51k; Tolerance_%: 5%; Value1: 5%; MountType: SMT; Technology: Thick Film; ComponentLink1Description: Datasheet link; ComponentLink1URL: http://www.vishay.com/docs/20035/dcrcwe3.pdf; Supplier 1: Digi-Key; Supplier Part Number 1: 541-51KJCT-ND; Supplier 2: Newark; Supplier Part Number 2: 89M6676; Supplier 3: Mouser; Supplier Part Number 3: 71-CRCW0402J-51K-E3; SizeArea_mm2: 0.5
R59 = CMP-0026284-2: RES, 30.1 k, 1%, 0.063 W, AEC-Q200 Grade 0, 0402; PartNumber: CRCW040230K1FKED; Manufacturer: Vishay-Dale; Alternate Manufacturer: YAGEO; Alternate PartNumber: RC0402FR-0730K1L; CompType: Resistor; Value: 30.1k; Value_Code: 30k1; Power_W: 63mW; Value2: 0.063W; VDC_V: 50V; TempCo: 100 ppm/C; EIA_Code: E96; SizeX_mm: 1; SizeY_mm: 0.5; SizeZ_mm: 0.6; AEC Qualified: Y; AEC Category: Q200; AEC Grade: 0; PackageReference: 0402; RoHS: E; Res_ohm: 30.1k; Tolerance_%: 1%; Value1: 1%; MountType: SMT; Technology: Thick Film; ComponentLink1Description: Datasheet link; ComponentLink1URL: http://www.vishay.com/docs/20035/dcrcwe3.pdf; Supplier 1: Digi-Key; Supplier Part Number 1: 541-30.1KLCT-ND; Supplier 2: Newark; Supplier Part Number 2: 52K6954; Supplier 3: Mouser; Supplier Part Number 3: 71-CRCW0402-30.1K-E3; SizeArea_mm2: 0.5
R61 R62 = CMP-0026659-1: RES, 100 k, 1%, 0.1 W, 0402; PartNumber: ERJ-2RKF1003X; Manufacturer: Panasonic; Alternate Manufacturer: YAGEO; Alternate PartNumber: RC0402FR-07100KL; Value: 100k; Power_W: 100mW; Value2: 0.1W; VDC_V: 50V; TempCo: 100 ppm/C; EIA_Code: E96; U/M: EA; SizeArea_mm2: 0.5; SizeX_mm: 1; SizeZ_mm: 0.6; AEC Category: Q200; CompType: Resistor; PackageReference: 0402; RoHS: Y; Res_ohm: 100k; Value_Code: 100k; Tolerance_%: 1%; Value1: 1%; MountType: SMT; Technology: Thick Film; Published: 2008-06-26; Publisher: Texas Instruments; LatestRevisionDate: 2017-03-09; ComponentLink1Description: Datasheet link; ComponentLink1URL: http://industrial.panasonic.com/www-data/pdf/AOA0000/AOA0000CE2.pdf; SizeY_mm: 0.5; AEC Qualified: ?
R63 = CMP-0026659-1: RES, 100 k, 1%, 0.1 W, 0402; PartNumber: ERJ-2RKF1003X; Manufacturer: Panasonic; Alternate Manufacturer: YAGEO; Alternate PartNumber: RC0402FR-07100KL; Value: 100k; Power_W: 100mW; Value2: 0.1W; VDC_V: 50V; TempCo: 100 ppm/C; EIA_Code: E96; U/M: EA; AEC Category: Q200; SizeX_mm: 1; SizeY_mm: 0.5; SizeZ_mm: 0.6; CompType: Resistor; PackageReference: 0402; RoHS: Y; Res_ohm: 100k; Value_Code: 100k; Tolerance_%: 1%; Value1: 1%; MountType: SMT; Technology: Thick Film; Published: 2008-06-26; Publisher: Texas Instruments; LatestRevisionDate: 2017-03-09; ComponentLink1Description: Datasheet link; ComponentLink1URL: http://industrial.panasonic.com/www-data/pdf/AOA0000/AOA0000CE2.pdf; AEC Qualified: ?; SizeArea_mm2: 0.5
R64 = CMP-0025874-3: RES, 0, 5%, 0.1 W, 0603; PartNumber: ERJ-3GEY0R00V; Manufacturer: Panasonic; Alternate Manufacturer: YAGEO; Alternate PartNumber: RC0603FR-070RL; CompType: Resistor; Value: 0; Value_Code: 0000; Power_W: 100mW; Value2: 0.1W; VDC_V: 50V; TempCo: 600 ppm/C; EIA_Code: E24; U/M: EA; SizeX_mm: 1.6; SizeY_mm: 0.8; SizeZ_mm: 1; SizeArea_mm2: 1.28; AEC Category: Q200; PackageReference: 0603; RoHS: Y; Res_ohm: 0; Tolerance_%: 5%; Value1: 5%; MountType: SMT; Technology: Thick Film; Published: 2008-06-26; Publisher: Texas Instruments; LatestRevisionDate: 2017-03-09; ComponentLink1Description: Datasheet link; ComponentLink1URL: http://www.panasonic.com/industrial/components/pdf/AOA0000CE1.pdf; Supplier 1: Digi-Key; Supplier Part Number 1: P0.0GCT-ND; Supplier 2: Mouser; Supplier Part Number 2: 667-ERJ-3GEY0R00V; Supplier 3: Farnell; Supplier Part Number 3: 2059527; AEC Qualified: ?
R65 = CMP-0025852-4: RES, 750, 5%, 0.1 W, AEC-Q200 Grade 0, 0603; PartNumber: CRCW0603750RJNEA; Manufacturer: Vishay-Dale; Alternate Manufacturer: YAGEO; Alternate PartNumber: RC0603JR-07750RL; Value: 750; Value_Code: 750R; Power_W: 100mW; Value2: 0.1W; VDC_V: 75V; TempCo: 200 ppm/C; EIA_Code: E24; AEC Category: Q200; AEC Qualified: Y; AEC Grade: 0; SizeArea_mm2: 1.28; SizeX_mm: 1.6; SizeY_mm: 0.8; SizeZ_mm: 1; CompType: Resistor; PackageReference: 0603; RoHS: E; Res_ohm: 750; Tolerance_%: 5%; Value1: 5%; MountType: SMT; Technology: Thick Film; ComponentLink1Description: Datasheet link; ComponentLink1URL: http://www.vishay.com/docs/20035/dcrcwe3.pdf; Supplier 1: Digi-Key; Supplier Part Number 1: 541-750GCT-ND; Supplier 2: Mouser; Supplier Part Number 2: 71-CRCW0603J-750-E3
R67 R68 = CMP-0026825-5: RES, 10 k, 5%, 0.063 W, AEC-Q200 Grade 0, 0402; PartNumber: CRCW040210K0JNED; Manufacturer: Vishay-Dale; Alternate Manufacturer: YAGEO; Alternate PartNumber: RC0402JR-0710KL; Value: 10k; Value_Code: 10k0; Power_W: 63mW; Value2: 0.063W; VDC_V: 50V; TempCo: 200 ppm/C; EIA_Code: E24; SizeX_mm: 1; SizeY_mm: 0.5; SizeZ_mm: 0.6; AEC Qualified: Y; AEC Category: Q200; AEC Grade: 0; CompType: Resistor; PackageReference: 0402; RoHS: E; Res_ohm: 10k; Tolerance_%: 5%; Value1: 5%; MountType: SMT; Technology: Thick Film; ComponentLink1Description: Datasheet link; ComponentLink1URL: http://www.vishay.com/docs/20035/dcrcwe3.pdf; Supplier 1: Digi-Key; Supplier Part Number 1: 541-10KJCT-ND; Supplier 2: Newark; Supplier Part Number 2: 59M6696; Supplier 3: Mouser; Supplier Part Number 3: 71-CRCW0402J-10K-E3; SizeArea_mm2: 0.5
R69 R70 = CMP-0026656-1: RES, 100, 1%, 0.1 W, 0402; PartNumber: ERJ-2RKF1000X; Manufacturer: Panasonic; Alternate Manufacturer: ----; CompType: Resistor; Value: 100; Value_Code: 100R; Power_W: 100mW; Value2: 0.1W; VDC_V: 50V; TempCo: 100 ppm/C; EIA_Code: E96; U/M: EA; SizeX_mm: 1; SizeY_mm: 0.5; SizeZ_mm: 0.6; AEC Category: Q200; PackageReference: 0402; RoHS: Y; Res_ohm: 100; Tolerance_%: 1%; Value1: 1%; MountType: SMT; Technology: Thick Film; Published: 2008-06-26; Publisher: Texas Instruments; LatestRevisionDate: 2017-03-09; ComponentLink1Description: Datasheet link; ComponentLink1URL: http://industrial.panasonic.com/www-data/pdf/AOA0000/AOA0000CE2.pdf; Alternate PartNumber: ----; Supplier 1: Digi-Key; Supplier Part Number 1: P100LCT-ND; Supplier 2: Newark; Supplier Part Number 2: 64R5246; Supplier 3: Mouser; Supplier Part Number 3: 667-ERJ-2RKF1000X; SizeArea_mm2: 0.5; AEC Qualified: ?
R71 = CMP-0025765-4: RES, 270, 5%, 0.1 W, AEC-Q200 Grade 0, 0603; PartNumber: CRCW0603270RJNEA; Manufacturer: Vishay-Dale; Alternate Manufacturer: ----; CompType: Resistor; Value: 270; Value_Code: 270R; Power_W: 100mW; Value2: 0.1W; VDC_V: 75V; TempCo: 200 ppm/C; EIA_Code: E24; SizeX_mm: 1.6; SizeY_mm: 0.8; SizeZ_mm: 1; SizeArea_mm2: 1.28; AEC Qualified: Y; AEC Category: Q200; AEC Grade: 0; PackageReference: 0603; RoHS: E; Res_ohm: 270; Tolerance_%: 5%; Value1: 5%; MountType: SMT; Technology: Thick Film; ComponentLink1Description: Datasheet link; ComponentLink1URL: http://www.vishay.com/docs/20035/dcrcwe3.pdf; Alternate PartNumber: ----; Supplier 1: Digi-Key; Supplier Part Number 1: 541-270GCT-ND; Supplier 2: Newark; Supplier Part Number 2: 59M6795; Supplier 3: Mouser; Supplier Part Number 3: 71-CRCW0603J-270-E3
R72 = CMP-0026852-3: RES, 1.0 k, 5%, 0.063 W, AEC-Q200 Grade 0, 0402; PartNumber: CRCW04021K00JNED; Manufacturer: Vishay-Dale; Alternate Manufacturer: YAGEO; Alternate PartNumber: RC0402JR-071KL; CompType: Resistor; Value: 1.0k; Res_ohm: 1k; Value_Code: 1k00; Power_W: 63mW; Value2: 0.063W; VDC_V: 50V; TempCo: 200 ppm/C; EIA_Code: E24; SizeX_mm: 1; SizeY_mm: 0.5; SizeZ_mm: 0.6; AEC Qualified: Y; AEC Category: Q200; AEC Grade: 0; PackageReference: 0402; RoHS: E; Tolerance_%: 5%; Value1: 5%; MountType: SMT; Technology: Thick Film; ComponentLink1Description: Datasheet link; ComponentLink1URL: http://www.vishay.com/docs/20035/dcrcwe3.pdf; Supplier 1: Digi-Key; Supplier Part Number 1: 541-1.0KJCT-ND; Supplier 2: Newark; Supplier Part Number 2: 59M6691; Supplier 3: Mouser; Supplier Part Number 3: 71-CRCW0402J-1.0K-E3; SizeArea_mm2: 0.5
SW1 SW2 = CMP-0002249-1: Switch, SPST-NO, Off-Mom, 1 Pos, 0.05A, 12VDC, TH; PartNumber: MJTP1117; Manufacturer: APEM; Alternate Manufacturer: ----; VDC_V: 12V; PositionCount: 1; CurrentRating_mA: 50A; MountType: TH; ComponentLink1Description: Datasheet Link; ComponentLink1URL: http://www.apem.com/files/apem/brochures/MJTP_6MM.pdf; RoHS: Y; Circuit: SPST-NO; SwitchFunction: Off-Mom; Orientation: Side Actuated; CompType: Switch; PackageReference: 7.3x5.9mm; Publisher: Texas Instruments; LatestRevisionDate: 2017-03-09; Alternate PartNumber: ----; Supplier 1: Digi-Key; Supplier Part Number 1: 679-2400-ND; Supplier 2: Newark; Supplier Part Number 2: 73J1184; Supplier 3: Mouser; Supplier Part Number 3: 642-MJTP1117
SW3 = CMP-0002328-1: Switch, SPST, 0.05 A, 12 VDC, SMD; Manufacturer: Diptronics; VDC_V: 12V; PositionCount: 1; CurrentRating_mA: 50A; SizeAreaWB_mm2: 53.9; SizeArea_mm2: 27.3; SizeX_mm: 7.8; SizeY_mm: 3.5; PartNumber: 1188E-1K2-V-TR; MountType: SMT; ComponentLink1Description: Datasheet URL; ComponentLink1URL: http://www.dip.com.tw/en/en-product-information/en-switch004/item/download/1976_b080c057386714e3a6604cbe658b9df3; RoHS: Y; Circuit: SPST; Orientation: Side Actuated; CompType: Switch; PackageReference: 7.8x3.5mm; Publisher: Texas Instruments; LatestRevisionDate: 2017-03-09; SizeZ_mm: 3.5
TP1 = CMP-0003719-1: Testpoint; PartNumber: TP_H0.45P0.75; Manufacturer: Texas Instruments; CompType: Pad; PackageReference: Test Point, 0.45mm hole size; MountType: TH; ComponentLink1Description: Datasheet Link; ComponentLink1URL: https://sps06.itg.ti.com/sites/KMS/crossdivteams/altium/docs/ComponentDatasheets/testpin with 750um Padsice and 450um drillhole.pdf; Publisher: Texas Instruments; LatestRevisionDate: 2017-03-09; Key: TP_H0.45P0.75
U3 = CMP-0036699-1: Single Output High PSRR LDO, 1 A, Adjustable 1.2 to 5.5 V Output, 2.7 to 5.5 V Input, 6-pin SOT-223 (DCQ), -40 to 125 degC, Green (RoHS & no Sb/Br); Manufacturer: Texas Instruments; Alternate PartNumber: ----; Vout Adj(Min)(V): 1.2; Accuracy(%): 2; Vout Adj(Max)(V): 5.5; SubFamily: Single Channel LDO; Vdo(Typ)(mV): 250; Vin(Min)(V): 2.7; Iout(Max)(A): 1; Iq(Typ)(mA): 0.26; PartNumber: TPS79601DCQR; PackageReference: DCQ0006A; ComponentLink1Description: Manufacturer URL; ComponentLink1URL: http://www.ti.com/; ComponentLink2Description: Datasheet; Eco-Plan: Green (RoHS & no Sb/Br); DatasheetVersion: SLVS351N; ComponentLink3Description: Package Specification; ComponentLink3URL: http://www.ti.com/litv/pdf/mpds098c; PackageVersion: 4202109/D; Mounting Technology: Surface Mount; ComponentLink2URL: http://www.ti.com/general/docs/lit/getliterature.tsp?genericPartNumber=TPS79601&fileType=pdf; Vin(Max)(V): 5.5; PackageDescription: 6-Pin Plastic Small Outline, Body 3.5 x 6.5 mm, Pitch 1.27 mm; Alternate Manufacturer: ----